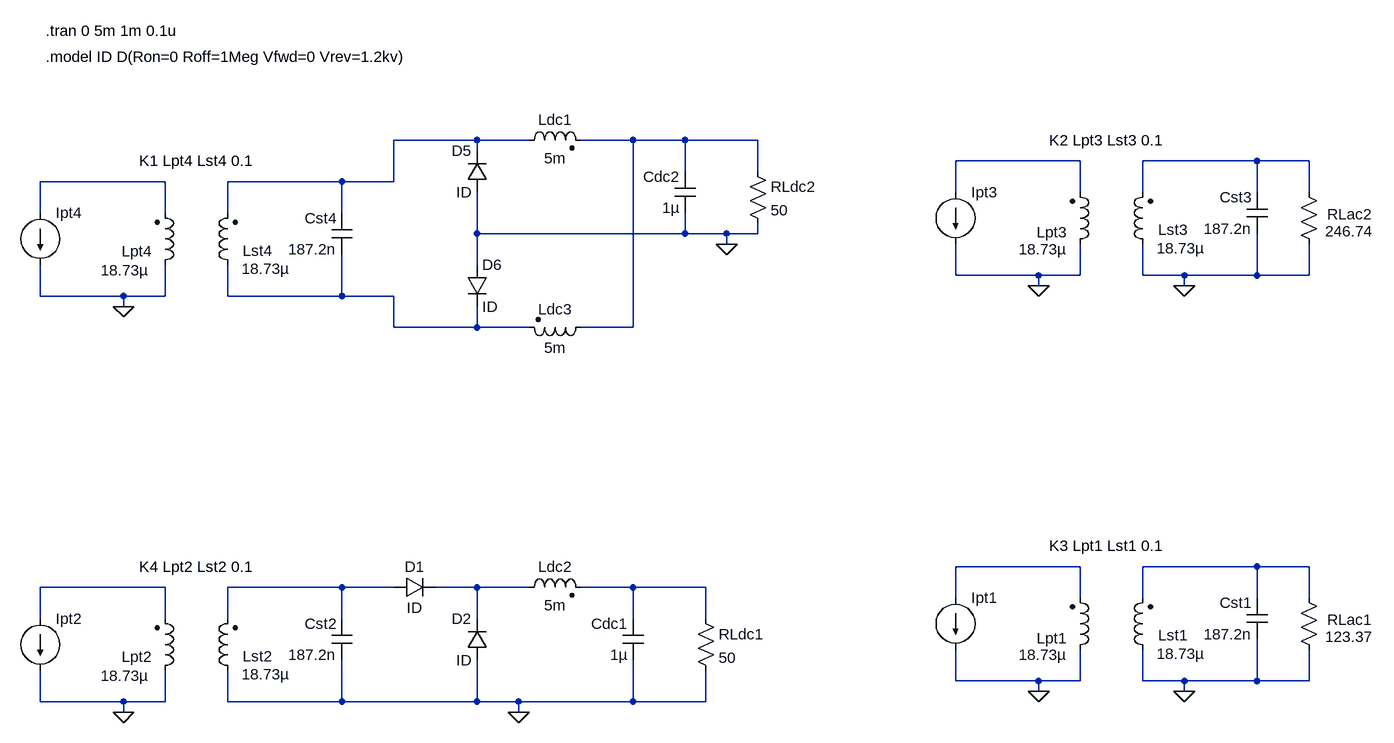
[diagram p0: schematic CurrentDoubler.asc]
CurrentDoubler.asc, the LTspice schematic file:
Version 4
SHEET 1 2108 1984
WIRE 688 224 560 224
WIRE 768 224 688 224
WIRE 928 224 848 224
WIRE 1008 224 928 224
WIRE 1120 224 1008 224
WIRE 688 240 688 224
WIRE 1616 256 1424 256
WIRE 1888 256 1712 256
WIRE 1968 256 1888 256
WIRE 1008 272 1008 224
WIRE 1120 272 1120 224
WIRE 208 288 16 288
WIRE 480 288 304 288
WIRE 560 288 560 224
WIRE 560 288 480 288
WIRE 1424 304 1424 256
WIRE 1616 304 1616 256
WIRE 1712 304 1712 256
WIRE 1888 304 1888 256
WIRE 1968 304 1968 256
WIRE 16 336 16 288
WIRE 208 336 208 288
WIRE 304 336 304 288
WIRE 480 336 480 288
WIRE 688 368 688 304
WIRE 1008 368 1008 336
WIRE 1008 368 688 368
WIRE 1072 368 1008 368
WIRE 1120 368 1120 352
WIRE 1120 368 1072 368
WIRE 1072 384 1072 368
WIRE 688 416 688 368
WIRE 1424 432 1424 384
WIRE 1552 432 1424 432
WIRE 1616 432 1616 384
WIRE 1616 432 1552 432
WIRE 1712 432 1712 384
WIRE 1776 432 1712 432
WIRE 1888 432 1888 368
WIRE 1888 432 1776 432
WIRE 1968 432 1968 384
WIRE 1968 432 1888 432
WIRE 1552 448 1552 432
WIRE 1776 448 1776 432
WIRE 16 464 16 416
WIRE 144 464 16 464
WIRE 208 464 208 416
WIRE 208 464 144 464
WIRE 304 464 304 416
WIRE 480 464 480 400
WIRE 480 464 304 464
WIRE 560 464 480 464
WIRE 144 480 144 464
WIRE 560 512 560 464
WIRE 688 512 688 480
WIRE 688 512 560 512
WIRE 768 512 688 512
WIRE 928 512 928 224
WIRE 928 512 848 512
WIRE 1616 880 1424 880
WIRE 1888 880 1712 880
WIRE 1968 880 1888 880
WIRE 208 912 16 912
WIRE 480 912 304 912
WIRE 560 912 480 912
WIRE 688 912 624 912
WIRE 768 912 688 912
WIRE 928 912 848 912
WIRE 1040 912 928 912
WIRE 1424 928 1424 880
WIRE 1616 928 1616 880
WIRE 1712 928 1712 880
WIRE 1888 928 1888 880
WIRE 1968 928 1968 880
WIRE 16 960 16 912
WIRE 208 960 208 912
WIRE 304 960 304 912
WIRE 480 960 480 912
WIRE 688 960 688 912
WIRE 928 960 928 912
WIRE 1040 960 1040 912
WIRE 1424 1056 1424 1008
WIRE 1552 1056 1424 1056
WIRE 1616 1056 1616 1008
WIRE 1616 1056 1552 1056
WIRE 1712 1056 1712 1008
WIRE 1776 1056 1712 1056
WIRE 1888 1056 1888 992
WIRE 1888 1056 1776 1056
WIRE 1968 1056 1968 1008
WIRE 1968 1056 1888 1056
WIRE 1552 1072 1552 1056
WIRE 1776 1072 1776 1056
WIRE 16 1088 16 1040
WIRE 144 1088 16 1088
WIRE 208 1088 208 1040
WIRE 208 1088 144 1088
WIRE 304 1088 304 1040
WIRE 480 1088 480 1024
WIRE 480 1088 304 1088
WIRE 688 1088 688 1024
WIRE 688 1088 480 1088
WIRE 752 1088 688 1088
WIRE 928 1088 928 1024
WIRE 928 1088 752 1088
WIRE 1040 1088 1040 1040
WIRE 1040 1088 928 1088
WIRE 144 1104 144 1088
WIRE 752 1104 752 1088
FLAG 1552 448 0
FLAG 1776 448 0
FLAG 144 480 0
FLAG 1552 1072 0
FLAG 1776 1072 0
FLAG 144 1104 0
FLAG 752 1104 0
FLAG 1072 384 0
SYMBOL ind2 1600 400 M180
WINDOW 0 -51 34 Left 2
WINDOW 3 -79 8 Left 2
SYMATTR InstName Lpt3
SYMATTR Value 18.73µ
SYMATTR Type ind
SYMBOL ind2 1728 400 R180
WINDOW 0 -54 38 Left 2
WINDOW 3 -80 10 Left 2
SYMATTR InstName Lst3
SYMATTR Value 18.73µ
SYMATTR Type ind
SYMATTR SpiceLine Rser=10m
SYMBOL current 1424 304 R0
WINDOW 3 24 80 Invisible 2
SYMATTR Value SINE(0 14.14 85k 0 0 0)
SYMATTR InstName Ipt3
SYMBOL res 1952 288 R0
WINDOW 0 44 50 Left 2
WINDOW 3 41 76 Left 2
SYMATTR InstName RLac2
SYMATTR Value 246.74
SYMBOL cap 1904 368 R180
WINDOW 0 24 56 Left 2
WINDOW 3 24 8 Left 2
SYMATTR InstName Cst3
SYMATTR Value 187.2n
SYMBOL ind2 192 432 M180
WINDOW 0 -51 37 Left 2
WINDOW 3 -83 8 Left 2
SYMATTR InstName Lpt4
SYMATTR Value 18.73µ
SYMATTR Type ind
SYMBOL ind2 320 432 R180
WINDOW 0 -53 38 Left 2
WINDOW 3 -80 10 Left 2
SYMATTR InstName Lst4
SYMATTR Value 18.73µ
SYMATTR Type ind
SYMATTR SpiceLine Rser=10m
SYMBOL current 16 336 R0
WINDOW 3 24 80 Invisible 2
SYMATTR Value SINE(0 14.14 85k 0 0 0)
SYMATTR InstName Ipt4
SYMBOL cap 496 400 R180
WINDOW 0 24 56 Left 2
WINDOW 3 24 8 Left 2
SYMATTR InstName Cst4
SYMATTR Value 187.2n
SYMBOL diode 704 304 R180
WINDOW 0 24 64 Left 2
WINDOW 3 24 0 Left 2
SYMATTR InstName D5
SYMATTR Value ID
SYMBOL diode 672 416 R0
SYMATTR InstName D6
SYMATTR Value ID
SYMBOL cap 1024 336 R180
WINDOW 0 24 56 Left 2
WINDOW 3 24 8 Left 2
SYMATTR InstName Cdc2
SYMATTR Value 1µ
SYMBOL res 1104 256 R0
SYMATTR InstName RLdc2
SYMATTR Value 50
SYMBOL ind2 752 240 R270
WINDOW 0 32 56 VTop 2
WINDOW 3 4 56 VBottom 2
SYMATTR InstName Ldc1
SYMATTR Value 5m
SYMATTR Type ind
SYMBOL ind2 1600 1024 M180
WINDOW 0 -51 34 Left 2
WINDOW 3 -79 8 Left 2
SYMATTR InstName Lpt1
SYMATTR Value 18.73µ
SYMATTR Type ind
SYMBOL ind2 1728 1024 R180
WINDOW 0 -54 38 Left 2
WINDOW 3 -80 10 Left 2
SYMATTR InstName Lst1
SYMATTR Value 18.73µ
SYMATTR Type ind
SYMATTR SpiceLine Rser=10m
SYMBOL current 1424 928 R0
WINDOW 3 24 80 Invisible 2
SYMATTR Value SINE(0 14.14 85k 0 0 0)
SYMATTR InstName Ipt1
SYMBOL res 1952 912 R0
WINDOW 0 44 50 Left 2
WINDOW 3 41 76 Left 2
SYMATTR InstName RLac1
SYMATTR Value 123.37
SYMBOL cap 1904 992 R180
WINDOW 0 24 56 Left 2
WINDOW 3 24 8 Left 2
SYMATTR InstName Cst1
SYMATTR Value 187.2n
SYMBOL ind2 192 1056 M180
WINDOW 0 -51 37 Left 2
WINDOW 3 -83 8 Left 2
SYMATTR InstName Lpt2
SYMATTR Value 18.73µ
SYMATTR Type ind
SYMBOL ind2 320 1056 R180
WINDOW 0 -53 38 Left 2
WINDOW 3 -80 10 Left 2
SYMATTR InstName Lst2
SYMATTR Value 18.73µ
SYMATTR Type ind
SYMATTR SpiceLine Rser=10m
SYMBOL current 16 960 R0
WINDOW 3 24 80 Invisible 2
SYMATTR Value SINE(0 14.14 85k 0 0 0)
SYMATTR InstName Ipt2
SYMBOL cap 496 1024 R180
WINDOW 0 24 56 Left 2
WINDOW 3 24 8 Left 2
SYMATTR InstName Cst2
SYMATTR Value 187.2n
SYMBOL diode 560 928 R270
WINDOW 0 32 32 VTop 2
WINDOW 3 0 32 VBottom 2
SYMATTR InstName D1
SYMATTR Value ID
SYMBOL diode 704 1024 R180
WINDOW 0 24 64 Left 2
WINDOW 3 24 0 Left 2
SYMATTR InstName D2
SYMATTR Value ID
SYMBOL cap 944 1024 R180
WINDOW 0 24 56 Left 2
WINDOW 3 24 8 Left 2
SYMATTR InstName Cdc1
SYMATTR Value 1µ
SYMBOL res 1024 944 R0
SYMATTR InstName RLdc1
SYMATTR Value 50
SYMBOL ind2 752 928 R270
WINDOW 0 32 56 VTop 2
WINDOW 3 4 56 VBottom 2
SYMATTR InstName Ldc2
SYMATTR Value 5m
SYMATTR Type ind
SYMBOL ind2 864 496 R90
WINDOW 0 4 56 VBottom 2
WINDOW 3 32 56 VTop 2
SYMATTR InstName Ldc3
SYMATTR Value 5m
SYMATTR Type ind
TEXT 24 56 Left 2 !.tran 0 5m 1m 0.1u
TEXT 24 96 Left 2 !.model ID D(Ron=0 Roff=1Meg Vfwd=0 Vrev=1.2kv)
TEXT 1568 224 Left 2 !K2 Lpt3 Lst3 0.1
TEXT 168 256 Left 2 !K1 Lpt4 Lst4 0.1
TEXT 1568 848 Left 2 !K3 Lpt1 Lst1 0.1
TEXT 168 880 Left 2 !K4 Lpt2 Lst2 0.1

The netlist it stands for:
* CurrentDoubler.asc
Lpt3 0 N003 18.73µ
Lst3 0 N004 18.73µ Rser=10m
Ipt3 N003 0 SINE(0 14.14 85k 0 0 0)
RLac2 N004 0 246.74
Cst3 0 N004 187.2n
Lpt4 0 N005 18.73µ
Lst4 N006 N001 18.73µ Rser=10m
Ipt4 N005 0 SINE(0 14.14 85k 0 0 0)
Cst4 N006 N001 187.2n
D5 0 N001 ID
D6 0 N006 ID
Cdc2 0 N002 1µ
RLdc2 N002 0 50
Ldc1 N001 N002 5m
Lpt1 0 N007 18.73µ
Lst1 0 N008 18.73µ Rser=10m
Ipt1 N007 0 SINE(0 14.14 85k 0 0 0)
RLac1 N008 0 123.37
Cst1 0 N008 187.2n
Lpt2 0 N009 18.73µ
Lst2 0 N010 18.73µ Rser=10m
Ipt2 N009 0 SINE(0 14.14 85k 0 0 0)
Cst2 0 N010 187.2n
D1 N010 N011 ID
D2 0 N011 ID
Cdc1 0 N012 1µ
RLdc1 N012 0 50
Ldc2 N011 N012 5m
Ldc3 N002 N006 5m
.model D D
.lib standard.dio
.tran 0 5m 1m 0.1u
.model ID D(Ron=0 Roff=1Meg Vfwd=0 Vrev=1.2kv)
K2 Lpt3 Lst3 0.1
K1 Lpt4 Lst4 0.1
K3 Lpt1 Lst1 0.1
K4 Lpt2 Lst2 0.1
.backanno
.end